# EasyEDA schematic SCH_HomeConv2_mit-IR_2026-09-25.json
TITLE: Sheet_1; REV: 1.0; Date: 2026-09-18; Sheet: 1/1; Drawn By: acreyy; Company: Your Company
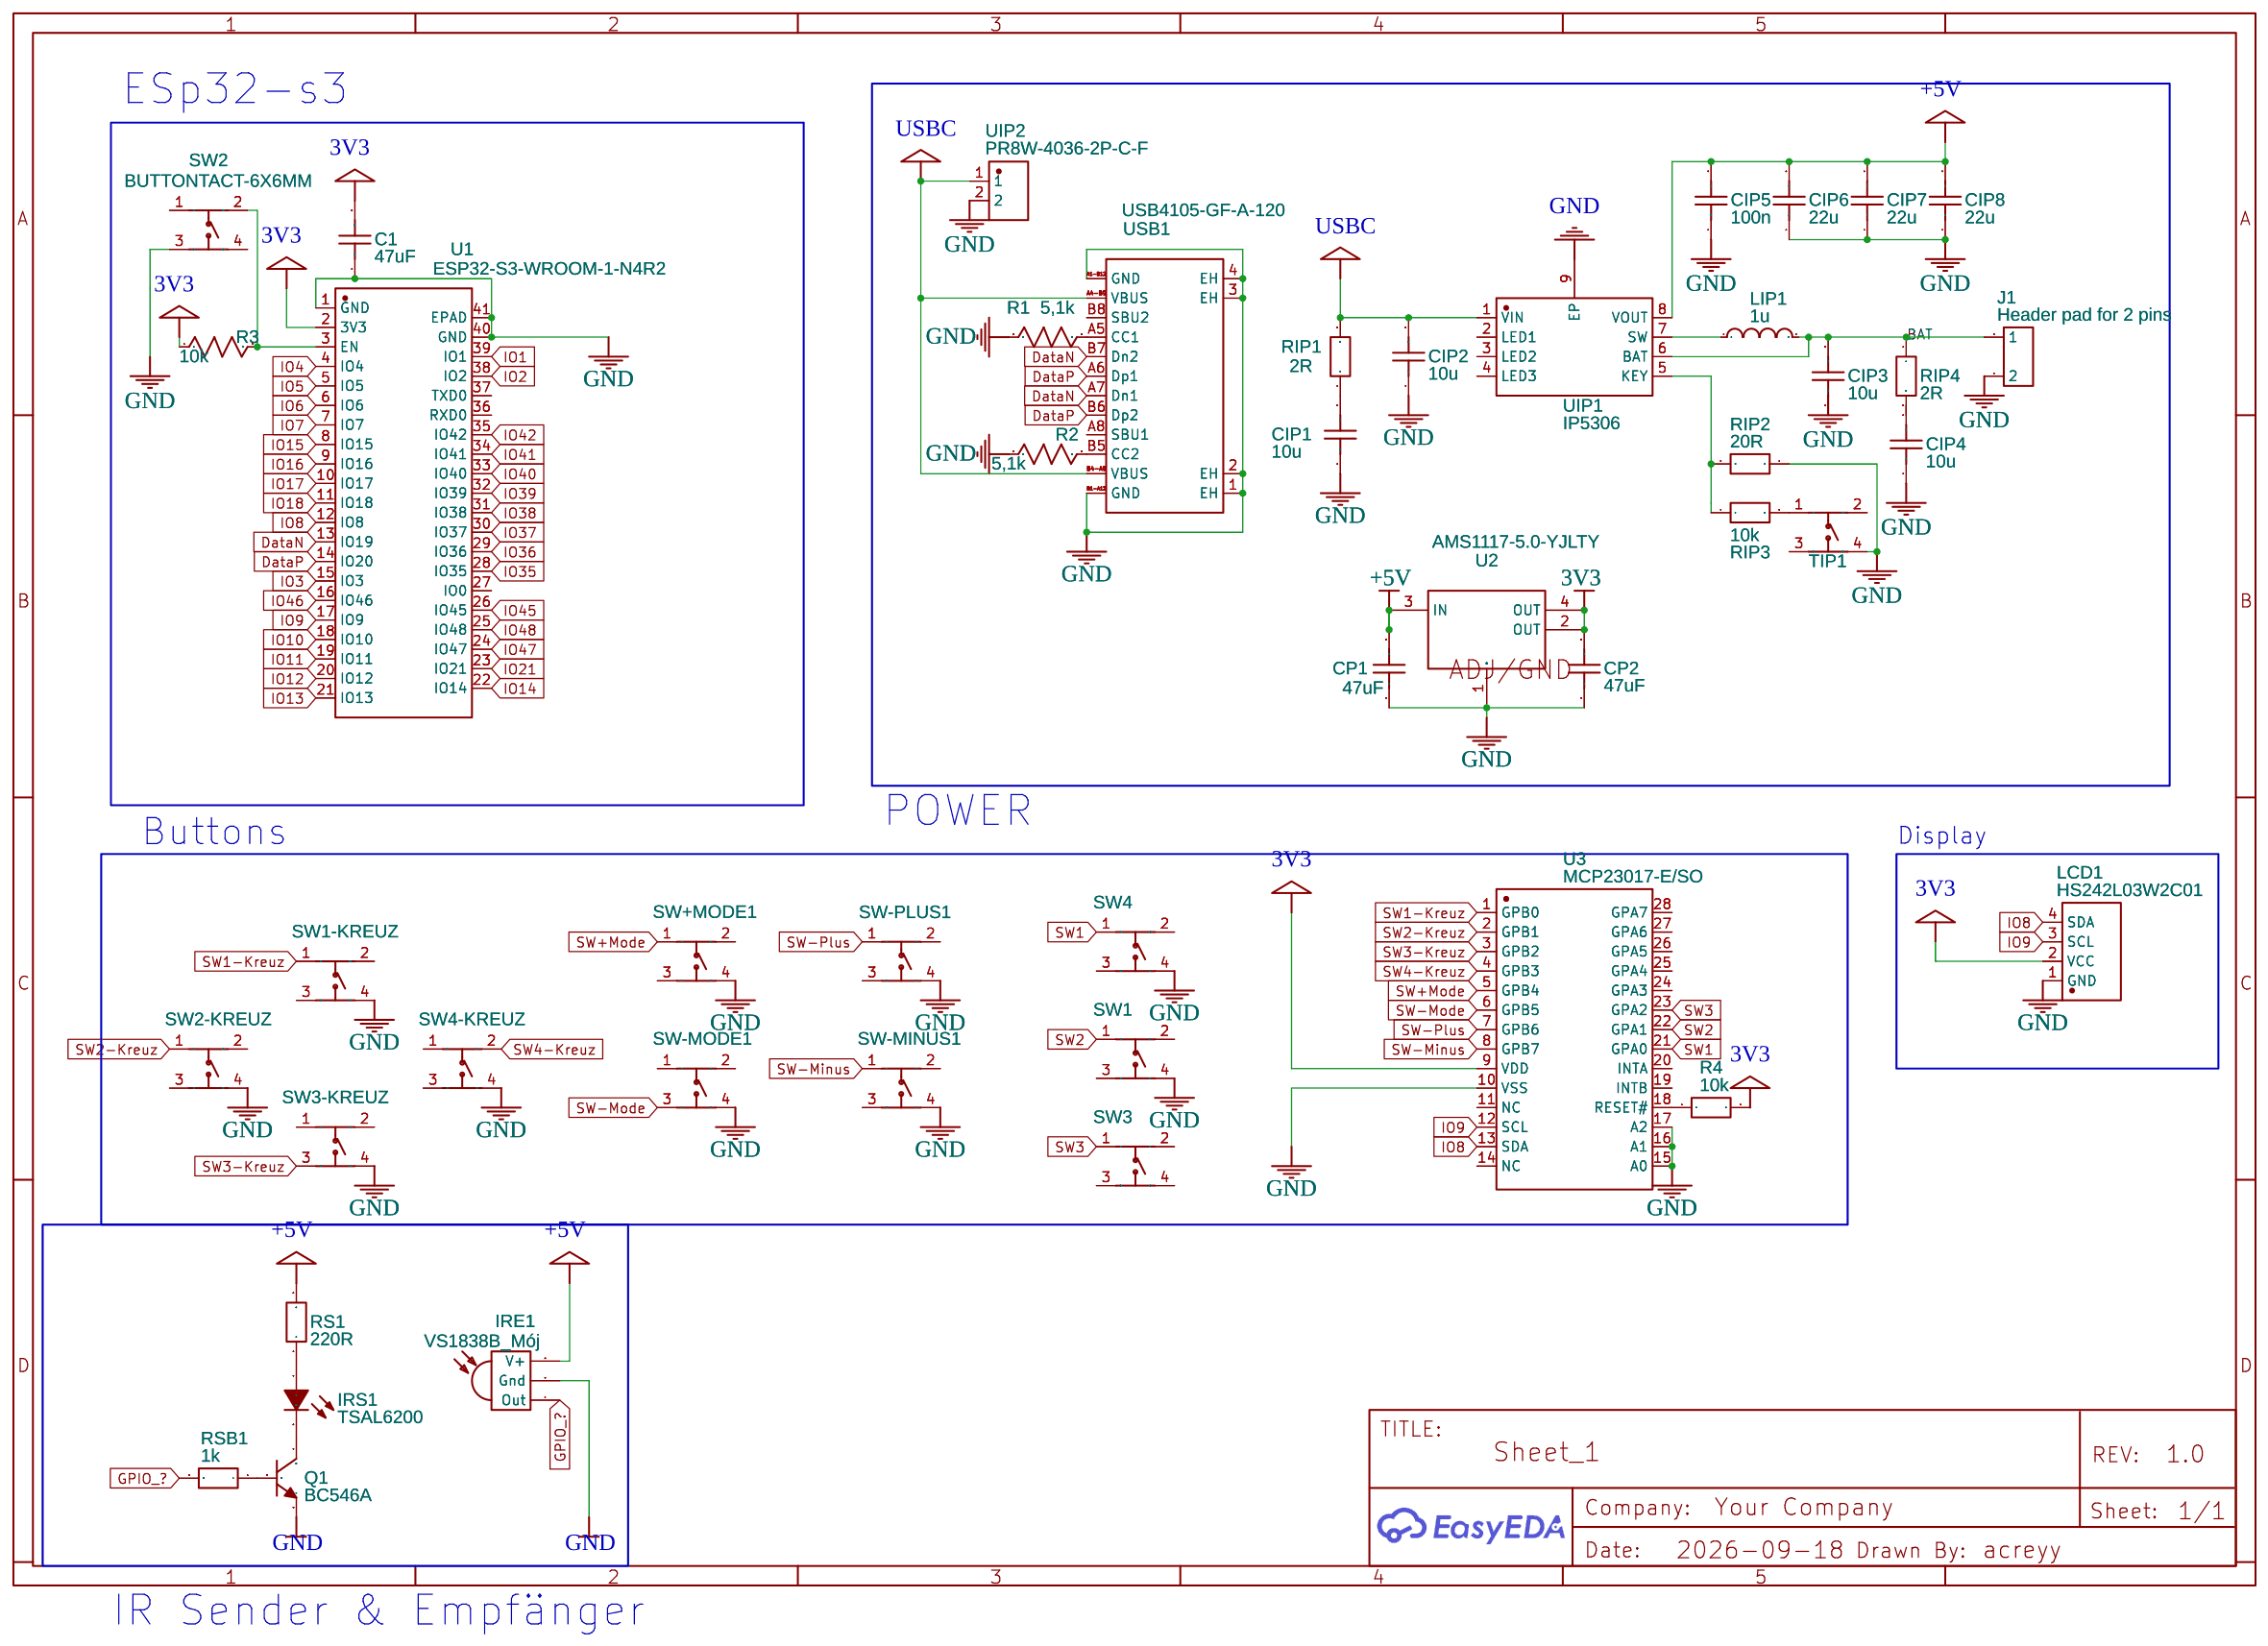
[diagram p0: schematic sheet]

## Parts
C1  47uF  [C0805]
CIP1  10u  [C0805]
CIP2  10u  [C0805]
CIP3  10u  [C0805]
CIP4  10u  [C0805]
CIP5  100n  [C0805]
CIP6  22u  [C0805]
CIP7  22u  [C0805]
CIP8  22u  [C0805]
CP1  47uF  [C0805]
CP2  47uF  [C0805]
IRE1  VS1838B_Mój  [VS1838B]
IRS1  TSAL6200  [LED-TH_BD5.0-P2.54-FD]
J1  Header pad for 2 pins  [CONNECTOR_PINHEADER_2.54MM:PINHEADER_1X11_P_2.54MM]
LCD1  HS242L03W2C01  [LCD-TH_4P-L72.0-W43.0-P2.54_HS242L03W2C01]
LIP1  1u  [L_AXIAL-0.4]
Q1  BC546A  [TO-92-3_L4.8-W3.7-P1.27-L-1]
R1  5,1k  [R0805]
R2  5,1k  [R0805]
R3  10k  [R0805]
R4  10k  [R0805]
RIP1  2R  [R0603]
RIP2  20R  [R0603]
RIP3  10k  [R0603]
RIP4  2R  [R0603]
RS1  220R  [R0805]
RSB1  1k  [R0805]
SW1  BUTTONTACT-6X6MM  [SW-SMD_4P-L6.0-W6.0-P4.50-LS9.2]
SW1-KREUZ  BUTTONTACT-6X6MM  [SW-SMD_4P-L6.0-W6.0-P4.50-LS9.2]
SW2  BUTTONTACT-6X6MM  [SW-SMD_4P-L6.0-W6.0-P4.50-LS9.2]
SW2-KREUZ  BUTTONTACT-6X6MM  [SW-SMD_4P-L6.0-W6.0-P4.50-LS9.2]
SW3  BUTTONTACT-6X6MM  [SW-SMD_4P-L6.0-W6.0-P4.50-LS9.2]
SW3-KREUZ  BUTTONTACT-6X6MM  [SW-SMD_4P-L6.0-W6.0-P4.50-LS9.2]
SW4  BUTTONTACT-6X6MM  [SW-SMD_4P-L6.0-W6.0-P4.50-LS9.2]
SW4-KREUZ  BUTTONTACT-6X6MM  [SW-SMD_4P-L6.0-W6.0-P4.50-LS9.2]
SW+MODE1  BUTTONTACT-6X6MM  [SW-SMD_4P-L6.0-W6.0-P4.50-LS9.2]
SW-MINUS1  BUTTONTACT-6X6MM  [SW-SMD_4P-L6.0-W6.0-P4.50-LS9.2]
SW-MODE1  BUTTONTACT-6X6MM  [SW-SMD_4P-L6.0-W6.0-P4.50-LS9.2]
SW-PLUS1  BUTTONTACT-6X6MM  [SW-SMD_4P-L6.0-W6.0-P4.50-LS9.2]
TIP1  BUTTONTACT-6X6MM  [SW-SMD_4P-L6.0-W6.0-P4.50-LS9.2]
U1  ESP32-S3-WROOM-1-N4R2  [WIRELM-SMD_ESP32-S3-WROOM-1]
U2  AMS1117-5.0-YJLTY  [SOT-223-3_L6.7-W3.7-P2.30-LS7.0-BR]
U3  MCP23017-E/SO  [SOIC-28_L18.0-W7.5-P1.27-LS10.3-BL]
UIP1  IP5306  [ESOP-8_L4.9-W3.9-P1.27-LS6.0-BL-EP]
UIP2  PR8W-4036-2P-C-F  [CONN-TH_PR8W-4036-2P-C-F]
USB1  USB4105-GF-A-120  [USB-C-SMD_MC-311D]

## Library data of the parts
C1 CIP1-CIP8 CP1 CP2 = C_0805_US: Contributor: LCEDA_Lib
IRE1 = VS1838B_Mój: Contributor: Kr W
IRS1 = TSAL6200: Supplier: LCSC; Manufacturer: VISHAY(威世); Supplier Part: C55528; JLCPCB Part Class: Extended Part
J1 = HEADER PAD 2X: Manufacturer: BOOMELE; Manufacturer Part: Female headerHDR1X8-2.54; Supplier Part: C27438; JLCPCB Part Class: Extended Part; Contributor: papisdieng22
LCD1 = HS242L03W2C01: Supplier: LCSC; Supplier Part: C7466001; Manufacturer: HS(汉昇)
LIP1 = L_AXIAL-0.4_US: Contributor: LCEDA_Lib
Q1 = BC546A: Supplier: LCSC; Supplier Part: C3201739; Manufacturer: onsemi(安森美); JLCPCB Part Class: Extended Part; Contributor: lcsc
R1-R3 = R_0805_US: Contributor: LCEDA_Lib
R4 RS1 RSB1 = R_0805_EU: Contributor: LCEDA_Lib
RIP1-RIP4 = R_0603_EU: Contributor: LCEDA_Lib
SW1 SW1-KREUZ SW2 SW2-KREUZ SW3 SW3-KREUZ SW4 SW4-KREUZ SW+MODE1 SW-MINUS1 SW-MODE1 SW-PLUS1 TIP1 = BUTTONTACT-6X6MM: Contributor: LCSC; Supplier: LCSC; Supplier Part: C9900004221; Manufacturer Part: Buttontact-6x6mm; Manufacturer: null; JLCPCB Part Class: Extended Part
U1 = ESP32-S3-WROOM-1-N4R2: Supplier: LCSC; Supplier Part: C2913203; Manufacturer: ESPRESSIF(乐鑫); JLCPCB Part Class: Extended Part; Contributor: lcsc
U2 = AMS1117-5.0-YJLTY: Contributor: lcsc; Supplier: LCSC; Supplier Part: C9900020131; Manufacturer: null; JLCPCB Part Class: Extended Part
U3 = MCP23017-E/SO: Contributor: LCSC; Supplier: LCSC; Manufacturer: MICROCHIP(美国微芯); Supplier Part: C47023; JLCPCB Part Class: Extended Part
UIP1 = IP5306: Contributor: LCSC; Supplier: LCSC; Supplier Part: C181692; Manufacturer: INJOINIC(英集芯); JLCPCB Part Class: Extended Part
UIP2 = PR8W-4036-2P-C-F: Supplier: LCSC; Supplier Part: C41361296; Manufacturer: SAMZO(三佐); Contributor: lcsc; JLCPCB Part Class: Extended Part
USB1 = USB4105-GF-A-120: Supplier: LCSC; Supplier Part: C5184243; Manufacturer: GCT; JLCPCB Part Class: Extended Part; Contributor: lcsc

## Nets
3V3: C1.2 CP2.2 LCD1.2(VCC) R3.1 R4.2 U1.2(3V3) U2.2(OUT) U2.4(OUT) U3.9(VDD)
+5V: CIP5.2 CIP6.2 CIP7.2 CIP8.2 CP1.2 IRE1.3(V+) RS1.2 U2.3(IN) UIP1.8(VOUT)
GND: C1.1 CIP1.1 CIP2.1 CIP4.1 CIP5.1 CIP6.1 CIP7.1 CIP8.1 CP1.1 CP2.1 IRE1.2(Gnd) J1.2 LCD1.1(GND) Q1.3(E) R1.1 R2.1 RIP2.1 SW1.4(D) SW1-KREUZ.4(D) SW2.3(C) SW2-KREUZ.4(D) SW3-KREUZ.4(D) SW4.4(D) SW4-KREUZ.4(D) SW+MODE1.4(D) SW-MINUS1.4(D) SW-MODE1.4(D) SW-PLUS1.4(D) TIP1.4(D) U1.1(GND) U1.40(GND) U1.41(EPAD) U2.1(ADJ/GND) U3.10(VSS) U3.15(A0) U3.16(A1) U3.17(A2) UIP1.9(EP) UIP2.2 USB1.1(EH) USB1.2(EH) USB1.3(EH) USB1.4(EH) USB1.A1-B12(GND) USB1.B1-A12(GND)
BAT: CIP3.2 J1.1 LIP1.2 RIP4.1 UIP1.6(BAT)
DataN: U1.13(IO19) USB1.A7(Dn1) USB1.B7(Dn2)
DataP: U1.14(IO20) USB1.A6(Dp1) USB1.B6(Dp2)
GPIO_?: IRE1.1(Out) RSB1.2
IO1: U1.39(IO1)
IO2: U1.38(IO2)
IO3: U1.15(IO3)
IO4: U1.4(IO4)
IO5: U1.5(IO5)
IO6: U1.6(IO6)
IO7: U1.7(IO7)
IO8: LCD1.4(SDA) U1.12(IO8) U3.13(SDA)
IO9: LCD1.3(SCL) U1.17(IO9) U3.12(SCL)
IO10: U1.18(IO10)
IO11: U1.19(IO11)
IO12: U1.20(IO12)
IO13: U1.21(IO13)
IO14: U1.22(IO14)
IO15: U1.8(IO15)
IO16: U1.9(IO16)
IO17: U1.10(IO17)
IO18: U1.11(IO18)
IO21: U1.23(IO21)
IO35: U1.28(IO35)
IO36: U1.29(IO36)
IO37: U1.30(IO37)
IO38: U1.31(IO38)
IO39: U1.32(IO39)
IO40: U1.33(IO40)
IO41: U1.34(IO41)
IO42: U1.35(IO42)
IO45: U1.26(IO45)
IO46: U1.16(IO46)
IO47: U1.24(IO47)
IO48: U1.25(IO48)
SW1: SW4.1(A) U3.21(GPA0)
SW1-Kreuz: SW1-KREUZ.1(A) U3.1(GPB0)
SW2: SW1.1(A) U3.22(GPA1)
SW2-Kreuz: SW2-KREUZ.1(A) U3.2(GPB1)
SW3: SW3.1(A) U3.23(GPA2)
SW3-Kreuz: SW3-KREUZ.3(C) U3.3(GPB2)
SW4-Kreuz: SW4-KREUZ.2(B) U3.4(GPB3)
SW+Mode: SW+MODE1.1(A) U3.5(GPB4)
SW-Minus: SW-MINUS1.1(A) U3.8(GPB7)
SW-Mode: SW-MODE1.3(C) U3.6(GPB5)
SW-Plus: SW-PLUS1.1(A) U3.7(GPB6)
USBC: CIP2.2 RIP1.2 UIP1.1(VIN) UIP2.1 USB1.A4-B9(VBUS) USB1.B4-A9(VBUS)
Net-(CIP1-2): CIP1.2 RIP1.1
Net-(IRS1-1): IRS1.1(A) RS1.1
Net-(IRS1-2): IRS1.2(C) Q1.1(C)
Net-(LIP1-1): LIP1.1 UIP1.7(SW)
Net-(Q1-2): Q1.2(B) RSB1.1
Net-(R1-2): R1.2 USB1.A5(CC1)
Net-(R2-2): R2.2 USB1.B5(CC2)
Net-(R3-2): R3.2 SW2.2(B) U1.3(EN)
Net-(R4-1): R4.1 U3.18(RESET#)
Net-(RIP2-2): RIP2.2 RIP3.1 UIP1.5(KEY)
Net-(RIP3-2): RIP3.2 TIP1.1(A)

Not connected (* = marked no-connect by the designer): CIP3 1; CIP4 2; RIP4 2; SW1 2(B) 3(C); SW1-KREUZ 2(B) 3(C); SW2 1(A) 4(D); SW2-KREUZ 2(B) 3(C); SW3 2(B) 3(C) 4(D); SW3-KREUZ 1(A) 2(B); SW4 2(B) 3(C); SW4-KREUZ 1(A) 3(C); SW+MODE1 2(B) 3(C); SW-MINUS1 2(B) 3(C); SW-MODE1 1(A) 2(B); SW-PLUS1 2(B) 3(C); TIP1 2(B) 3(C); U1 27(IO0) 36(RXD0) 37(TXD0); U3 11(NC) 14(NC) 19(INTB) 20(INTA) 24(GPA3) 25(GPA4) 26(GPA5) 27(GPA6) 28(GPA7); UIP1 2(LED1) 3(LED2) 4(LED3); USB1 A8(SBU1) B8(SBU2)

## Notes on the sheet
- ESp32-s3
- POWER
- Buttons
- Display
- IR Sender & Empfänger
